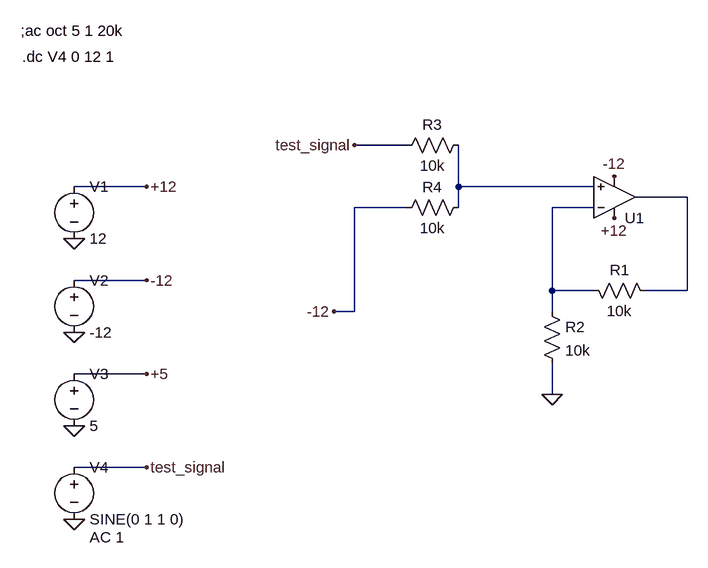
[diagram p0: schematic voltage-bias.asc]
voltage-bias.asc, the LTspice schematic file:
Version 4
SHEET 1 996 680
WIRE 560 -160 480 -160
WIRE 160 -96 48 -96
WIRE 640 -96 640 -160
WIRE 848 -96 640 -96
WIRE 992 -80 912 -80
WIRE 560 -64 480 -64
WIRE 640 -64 640 -96
WIRE 848 -64 784 -64
WIRE 160 48 48 48
WIRE 784 64 784 -64
WIRE 848 64 784 64
WIRE 992 64 992 -80
WIRE 992 64 928 64
WIRE 480 96 480 -64
WIRE 480 96 448 96
WIRE 784 96 784 64
WIRE 160 192 48 192
WIRE 784 224 784 176
WIRE 160 336 48 336
FLAG 48 -16 0
FLAG 48 128 0
FLAG 48 272 0
FLAG 48 416 0
FLAG 160 -96 +12
FLAG 160 48 -12
FLAG 160 192 +5
FLAG 160 336 test_signal
FLAG 880 -48 +12
FLAG 880 -112 -12
FLAG 784 224 0
FLAG 480 -160 test_signal
FLAG 448 96 -12
SYMBOL voltage 48 -112 R0
WINDOW 123 0 0 Left 0
WINDOW 39 0 0 Left 0
SYMATTR InstName V1
SYMATTR Value 12
SYMBOL voltage 48 32 R0
WINDOW 123 0 0 Left 0
WINDOW 39 0 0 Left 0
SYMATTR InstName V2
SYMATTR Value -12
SYMBOL voltage 48 176 R0
WINDOW 123 0 0 Left 0
WINDOW 39 0 0 Left 0
SYMATTR InstName V3
SYMATTR Value 5
SYMBOL voltage 48 320 R0
WINDOW 123 24 124 Left 2
WINDOW 39 0 0 Left 0
SYMATTR InstName V4
SYMATTR Value SINE(0 1 1 0)
SYMATTR Value2 AC 1
SYMBOL OpAmps\\UniversalOpAmp 880 -80 M180
SYMATTR InstName U1
SYMBOL res 944 80 M270
WINDOW 0 32 56 VTop 2
WINDOW 3 0 56 VBottom 2
SYMATTR InstName R1
SYMATTR Value 10k
SYMBOL res 768 80 R0
SYMATTR InstName R2
SYMATTR Value 10k
SYMBOL res 656 -176 R90
WINDOW 0 0 56 VBottom 2
WINDOW 3 32 56 VTop 2
SYMATTR InstName R3
SYMATTR Value 10k
SYMBOL res 656 -80 R90
WINDOW 0 0 56 VBottom 2
WINDOW 3 32 56 VTop 2
SYMATTR InstName R4
SYMATTR Value 10k
TEXT -34 -336 Left 2 !;ac oct 5 1 20k
TEXT -32 -296 Left 2 !.dc V4 0 12 1

The netlist it stands for:
* voltage-bias.asc
V1 +12 0 12
V2 -12 0 -12
V3 +5 0 5
V4 test_signal 0 SINE(0 1 1 0) AC 1
XU1 N001 N003 +12 -12 N002 level1 Avol=1Meg GBW=10Meg Vos=0 En=0 Enk=0 In=0 Ink=0 Rin=500Meg  ; pins In+ In- V+ V- OUT
R1 N002 N003 10k
R2 N003 0 10k
R3 N001 test_signal 10k
R4 N001 -12 10k
;ac oct 5 1 20k
.dc V4 0 12 1
.lib UniversalOpAmp1.lib
.backanno
.end